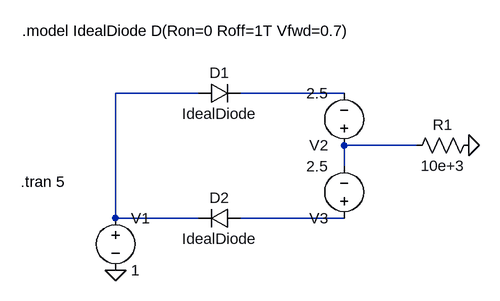
[diagram p0: schematic parallel_diode.asc]
parallel_diode.asc, the LTspice schematic file:
Version 4
SHEET 1 880 680
WIRE 176 176 48 176
WIRE 400 176 240 176
WIRE 512 256 400 256
WIRE 400 288 400 256
WIRE 48 368 48 176
WIRE 176 368 48 368
WIRE 400 368 240 368
FLAG 48 448 0
FLAG 592 256 0
SYMBOL voltage 48 352 R0
WINDOW 123 0 0 Left 0
WINDOW 39 0 0 Left 0
SYMATTR InstName V1
SYMATTR Value 1
SYMBOL diode 176 192 R270
WINDOW 0 32 32 VTop 2
WINDOW 3 0 32 VBottom 2
SYMATTR InstName D1
SYMATTR Value IdealDiode
SYMBOL diode 240 352 R90
WINDOW 0 0 32 VBottom 2
WINDOW 3 32 32 VTop 2
SYMATTR InstName D2
SYMATTR Value IdealDiode
SYMBOL voltage 400 272 R180
WINDOW 123 0 0 Left 0
WINDOW 39 0 0 Left 0
SYMATTR InstName V2
SYMATTR Value 2.5
SYMBOL voltage 400 384 R180
WINDOW 123 0 0 Left 0
WINDOW 39 0 0 Left 0
SYMATTR InstName V3
SYMATTR Value 2.5
SYMBOL res 608 240 R90
WINDOW 0 0 56 VBottom 2
WINDOW 3 32 56 VTop 2
SYMATTR InstName R1
SYMATTR Value 10e+3
TEXT -96 80 Left 2 !.model IdealDiode D(Ron=0 Roff=1T Vfwd=0.7)
TEXT -98 312 Left 2 !.tran 5

The netlist it stands for:
* parallel_diode.asc
V1 N001 0 1
D1 N001 N002 IdealDiode
D2 N004 N001 IdealDiode
V2 N003 N002 2.5
V3 N004 N003 2.5
R1 0 N003 10e+3
.model D D
.lib standard.dio
.model IdealDiode D(Ron=0 Roff=1T Vfwd=0.7)
.tran 5
.backanno
.end